# Altium project Claraboia.PrjPcb (part 1 of 2)
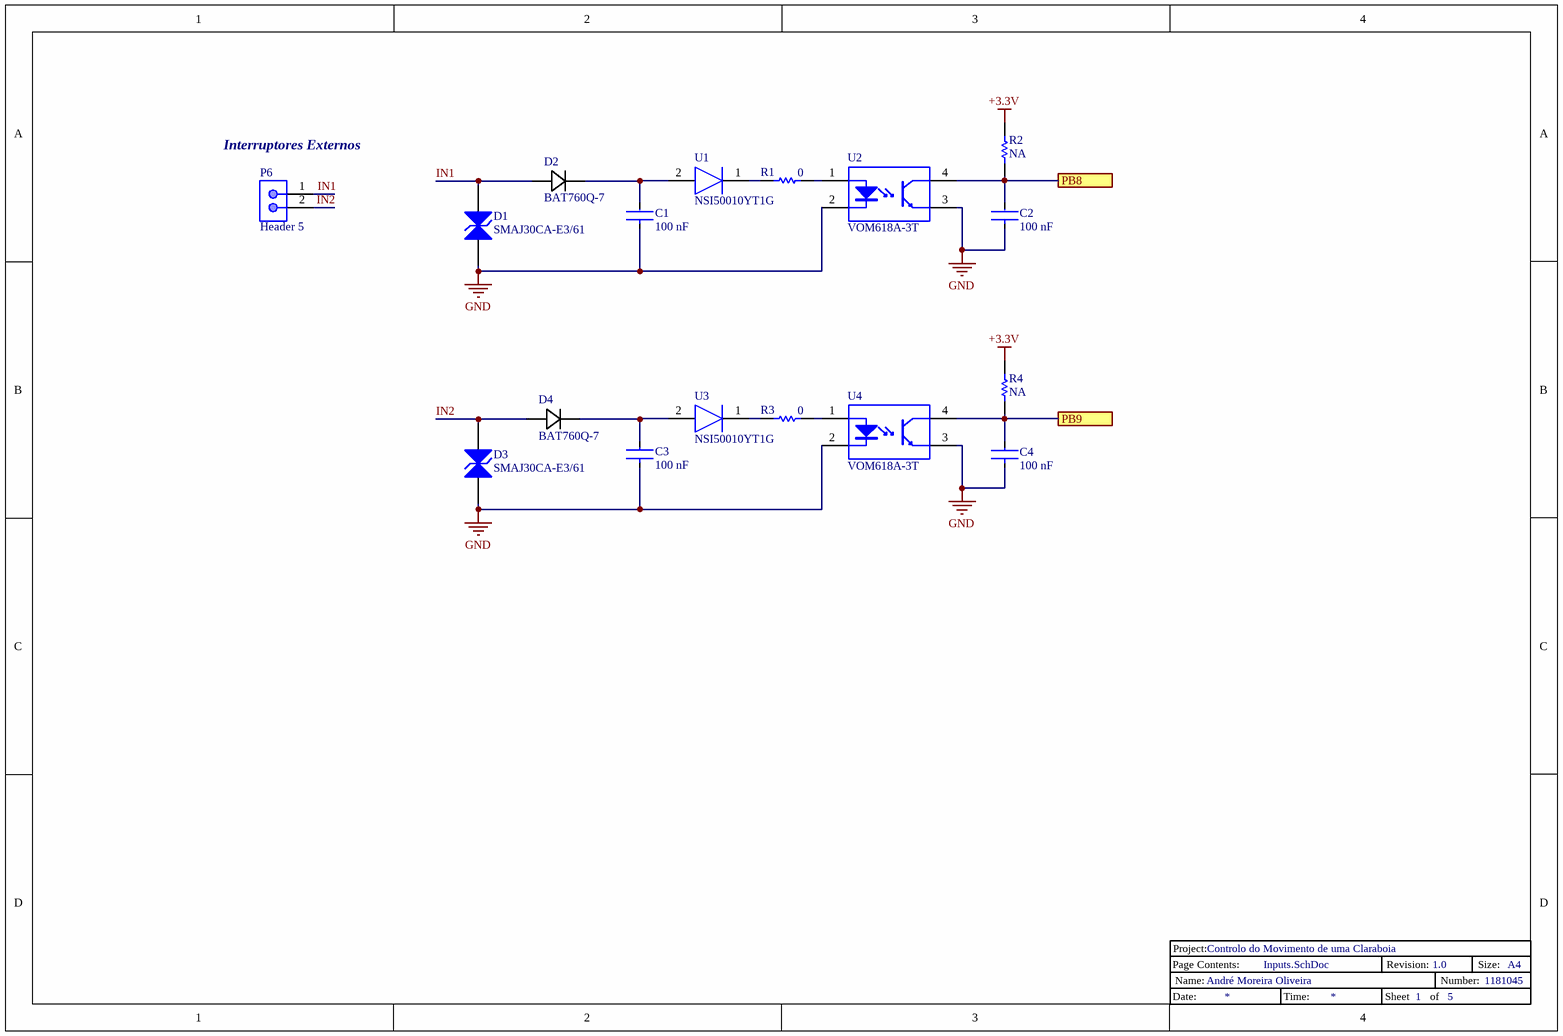
[diagram p0: Inputs.SchDoc]
AuthorProject: André Moreira Oliveira; Number: 1181045; Project: Controlo do Movimento de uma Claraboia; RevisionSch: 1.0
5 sheets, 189 parts. Net scope: flat (ports and power ports of the same name join across sheets).
Board file: PCB2.PcbDoc
Sheets:
  Inputs.SchDoc
  Source.SchDoc
  RS-485.SchDoc
  MCU_F401RE.SchDoc
  powerSTEP01.SchDoc

## Sheet Inputs.SchDoc: Controlo do Movimento de uma Claraboia
size A4; Author: André Moreira Oliveira; DocumentNumber: 1; Revision: 0.1; SheetNumber: 1; SheetTotal: 5; Number: 1181045

### Parts
C1  100 nF  [FP-CC0603-DA-MFG]
C2  100 nF  [FP-CC0603-DA-MFG]
C3  100 nF  [FP-CC0603-DA-MFG]
C4  100 nF  [FP-CC0603-DA-MFG]
D1  SMAJ30CA-E3/61  [VISH-DO-214AC-2_L]
D2  BAT760Q-7  [DIODE_SOD-323_1P7X1P3_DIO-L]
D3  SMAJ30CA-E3/61  [VISH-DO-214AC-2_L]
D4  BAT760Q-7  [DIODE_SOD-323_1P7X1P3_DIO-L]
P6  Header 5  [MOLX-22-27-2021_V]
R1  0  [RESC1608X55X25ML10T15]
R2  NA  [RESC1608X55X25ML10T15]
R3  0  [RESC1608X55X25ML10T15]
R4  NA  [RESC1608X55X25ML10T15]
Title_Block_1  Title_Block  (value not drawn)
U1  NSI50010YT1G  [SOD3716X135N]
U2  VOM618A-3T  [VISH-SOP-4_V]
U3  NSI50010YT1G  [SOD3716X135N]
U4  VOM618A-3T  [VISH-SOP-4_V]

### Ports
PB8, PB9

### Nets
+3.3V: R2.2 R4.2
GND: C1.1 C2.1 C3.1 C4.1 D1.1(A1) D3.1(A1) U2.2(CATHODE) U2.3(EMITTER) U4.2(CATHODE) U4.3(EMITTER)
IN1: D1.2(A2) D2.2 P6.1
IN2: D3.2(A2) D4.2 P6.2
NetC1_2: C1.2 D2.1 U1.2(A)
NetC2_2: C2.2 R2.1 U2.4(COLLECTOR) ; port PB8
NetC3_2: C3.2 D4.1 U3.2(A)
NetC4_2: C4.2 R4.1 U4.4(COLLECTOR) ; port PB9
NetR1_1: R1.1 U1.1(K)
NetR1_2: R1.2 U2.1(ANODE)
NetR3_1: R3.1 U3.1(K)
NetR3_2: R3.2 U4.1(ANODE)

### Notes on the sheet
- (near P6) Interruptores Externos
- (in symbol Title_Block) Project:; Page Contents:; Revision:; Size:; A4; Name:; Number:; Date:; Time:; Sheet; of

### Library data of the parts
C1-C4 = CMP-2100-03601-2: CAP CER 0.1UF 50V X7R 0603; Manufacturer: YAGEO; Manufacturer Part Number: CC0603KRX7R9BB104; Material: Ceramic; Temperature Coefficient: 15%; Tolerance: 0.1; Height: 0.9mm; Voltage: 50 V; ComponentLink2Description: Datasheet; Device Class L2: Capacitors; Temperature Range High: +125°C; Category: Cap; Capacitance: 100 nF; Footprint Url: http://www.yageo.com/exep/pages/download/literatures/UPY-C_GEN_24.pdf; ComponentLink2URL: http://www.yageo.com/documents/recent/UPY-GPHC_X7R_6.3V-to-50V_18.pdf; Package: CC0603-DA; Temperature: -55°C to +125°C; Voltage Rating: 50 V; Temperature Characteristic: X7R; Device Class L1: Passive Components; Temperature Range Low: -55°C; RoHS: TRUE; Automotive: No; Value: 100 nF; Device Class L3: Ceramic Capacitors; Octopart: https://octopart.com/cc0603krx7r9bb104-yageo-42244635; Mouser Description: Multilayer Ceramic Capacitor, CC Series, 0.1 - F, - 10%, X7R, 50 V, 0603 [1608 Metric]; Lead Free: Yes; Digikey Description: CAP CER 0.1UF 50V X7R 0603
D1 D3 = CMP-0548-00185-2: Transient Voltage Suppressor, 6.40 to 231 V, 30 V Stand-off Voltage, Bi-Directional, -55 to 155 degC, 2-pin DO-214AC, Pb-Free, Tape and Reel; Manufacturer: Vishay Semiconductor; ID (uA): 2; IFSM: 40 A; PPPM (W): 400, 300; VWM (V): 30; VBR Bi-Directional (V): 6.4 to 231; PartNumber: SMAJ30CA-E3/61; Mounting Technology: Surface Mount; Operating Junction and Storage Temperature Range: -55 to 150 degC; ComponentLink1Description: Manufacturer URL; PackageReference: DO-214AC-2; ComponentLink3URL: http://www.vishay.com/docs/88390/smaj50a.pdf; ComponentLink2URL: http://www.vishay.com/docs/88390/smaj50a.pdf; RoHS: TRUE; DatasheetVersion: 12/8/2013; Packing: Tape and Reel; ComponentLink1URL: http://www.vishay.com/; ComponentLink2Description: Datasheet; ComponentLink3Description: Package Specification; PackageDescription: 2-Pin DO-214AC (SMA), Body 4.245 x 2.665 mm
D2 D4 = BAT760Q-7: No Description Available; Vendor: Diodes Inc; Built_By: EMA_Anthony; SourceLibrary: Diodes_Inc_2020-03-05; Type: DEV; Datasheet: https://media.digikey.com/pdf/Data%20Sheets/Diodes%20PDFs/BAT760.pdf; Copyright: Copyright (C) 2018 Accelerated Designs. All rights reserved; Manufacturer_Part_Number: BAT760Q-7; RefDes: RefDes
P6 = CMP-2000-05537-1: Male Header, Pitch 2.54 mm, 1 x 2 Position, Height 11.7 mm, Tail Length 3.56 mm, 0 to 75 degC, RoHS, Bulk; Manufacturer: Molex; PartNumber: 0022272021; Current rating: 4A; Package Version: Rev. BC, 02/2012; Voltage rating: 250V; No. of Positions: 2; Pitch: 2.54mm; No. of Rows: 1; Orientation: Vertical; Operating temperature: 0°Cto+75°C; Manufacturer URL: http://www.molex.com/; Mounting Technology: ThroughHole; Housing material: Nylon(UL94V-0); Package Description: 2-Leads Header, Body 5.08 x 5.8 mm, Pitch 2.54 mm; Voltage - Max: 250V; Datasheet URL: http://www.molex.com/pdm_docs/sd/022272021_sd.pdf; Package Reference: 22-27-2021; Contact material: Tinplatedbrass; Current - Max: 4A; Datasheet Version: Rev. F, 06/2009
R1-R4 = CMP-2100-03667-1: Chip Resistor, 0 Ohm, +/- 5%, 0.1 W, -55 to 155 degC, 0603 (1608 Metric), RoHS, Tape and Reel; Manufacturer: Yageo; Temperature Coefficient: 200ppm/degreesC; Voltage Rating: 50V; Power Rating: 100mW; Resistance: 0mOhm; Width: 0.8mm; Max Operating Temperature: 155degC; Tolerance: 5%; Package Reference: 0603; Height: 0.45mm; Depth: 0.8mm; Package Description: 2-Pin Surface Mount Device, Body 1.6 x 0.8 mm; Termination: SMD/SMT; Package Quantity: 5000; Case/Package: 0603; Case Code (Imperial): 0603; Radiation Hardening: No; Number of Pins: 2; Length: 1.6mm; Lead Free: LeadFree; Voltage Rating (DC): 50V; Military Standard: Not; Datasheet URL: http://www.yageo.com/NewPortal/yageodocoutput?fileName=/pdf/R-Chip/PYu-RC_Group_51_RoHS_L_5.pdf; Manufacturer URL: http://www.yageo.com/; Packaging: TapeandReel; Case Code (Metric): 1608; Min Operating Temperature: -55degC; Composition: ThickFilm; RoHSCompliant: true; Contact Plating: Tin; Datasheet Version: Rev. 5, 10/2016; REACH SVHC: NoSVHC
U1 U3 = NSI50010YT1G: Diode; Manufacturer_Name: ON Semiconductor; Datasheet Link: http://www.onsemi.com/pub/Collateral/NSI50010Y-D.PDF; Height: 1.35mm; Manufacturer_Part_Number: NSI50010YT1G; Mouser Part Number: 863-NSI50010YT1G; Mouser Price/Stock: https://www.mouser.co.uk/ProductDetail/ON-Semiconductor/NSI50010YT1G?qs=dubiLKbpNDpeXNVeIAV4bg%3D%3D; Arrow Part Number: NSI50010YT1G; Arrow Price/Stock: https://www.arrow.com/en/products/nsi50010yt1g/on-semiconductor
U2 U4 = CMP-2000-07401-1: Low Input Current, Phototransistor Output, 80 V, 170 mW, -55 to 110 degC, 4-Pin SOP, RoHS, Tape and Reel; Manufacturer: Vishay; Input Type: DC; Voltage - Isolation: 3750Vrms; Turn On / Turn Off Time (Typ): 7µs,6µs; Current Transfer Ratio (Min): 100%@1mA; Current - DC Forward (If) (Max): 60mA; Online Catalog: VOM617A,VOM618ASeries; Voltage - Output (Max): 80V; Voltage - Forward (Vf) (Typ): 1.1V; Current - Output / Channel: 50mA; Rise / Fall Time (Typ): 5µs,4µs; Other Names: VOM618A-3CT; Current Transfer Ratio (Max): 200%@1mA; Number of Channels: 1; Vce Saturation (Max): 400mV; Category: Isolators; Standard Package: 1; Mounting Type: SurfaceMount; Output Type: Transistor; Mounting Technology: SurfaceMount; Manufacturer URL: http://www.vishay.com/; Package Reference: SOP-4; Supplier Device Package: 4-SOP(2.54mm); Packaging: CutTape(CT); Family: Optoisolators-Transistor,PhotovoltaicOutput; Datasheet Version: Rev. 1.4, 10/2013; Package Description: 4-Pin Small Outline Package Integrated Circuit, Body 4.4 x 3.85 mm, Pitch 2.54 mm; Operating Temperature: -55°C~110°C; Series: -; Package / Case: 4-SMD,GullWing; Datasheet URL: http://download.siliconexpert.com/pdfs/2016/3/15/21/48/34/980/vsh_/manual/832624671428055vom618a.pdf

## Sheet Source.SchDoc
size A4; DocumentNumber: 2; SheetNumber: 2; SheetTotal: 5
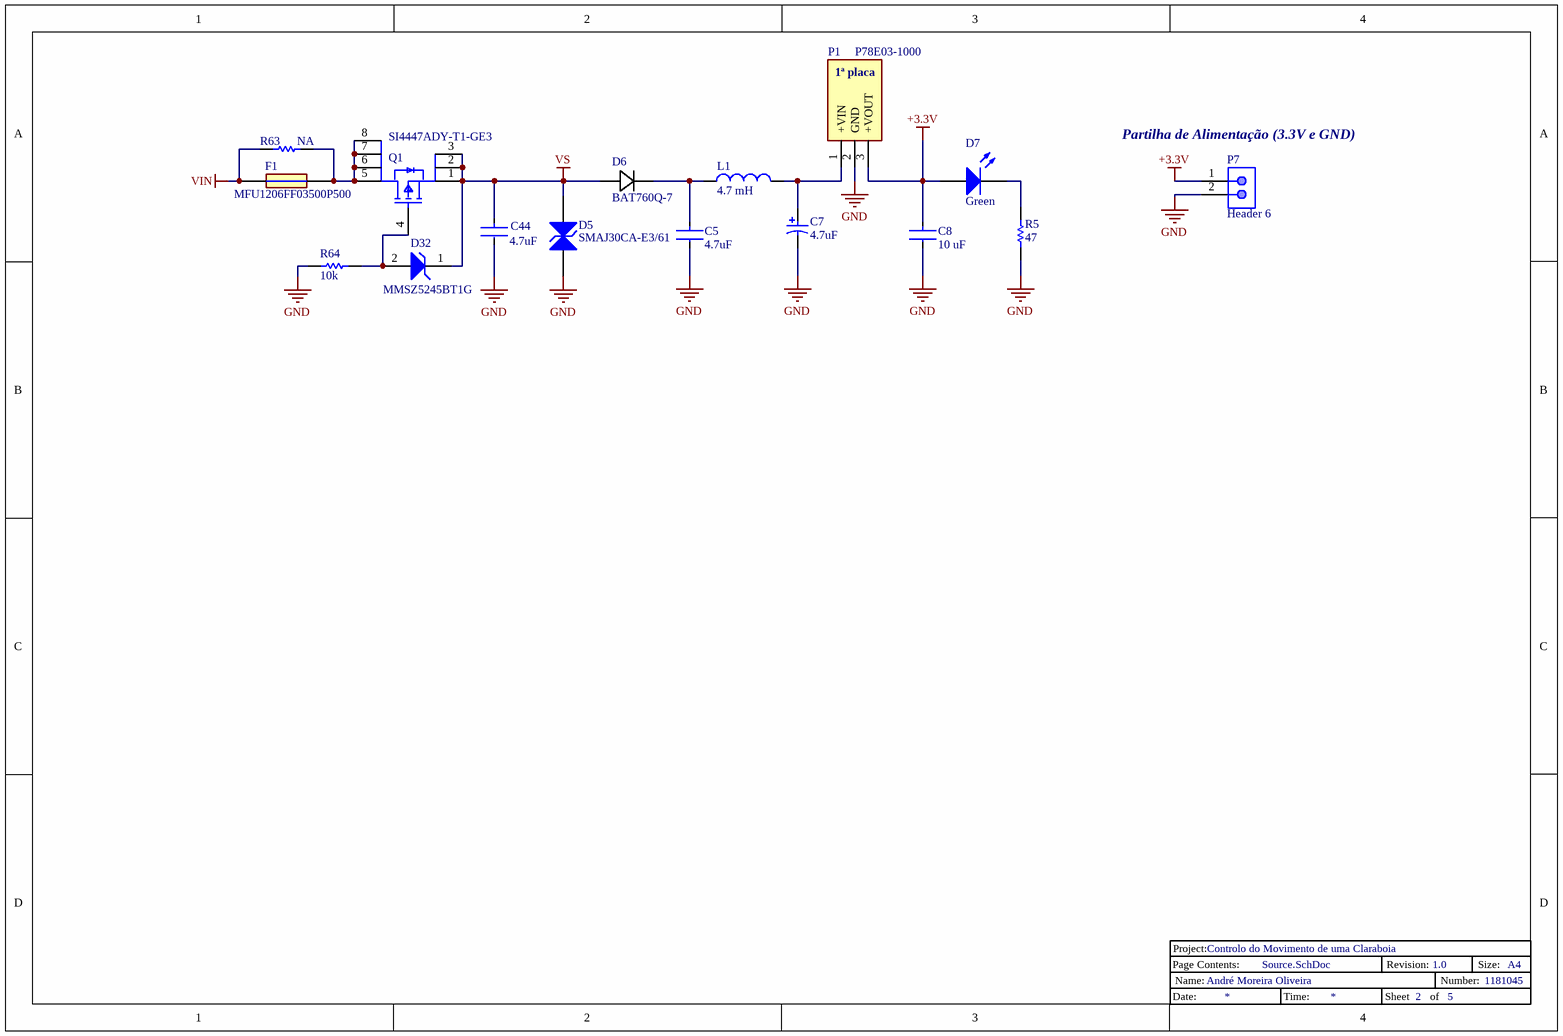
[diagram p1: Source.SchDoc]

### Parts
C5  4.7uF  [FP-GRT21B-0_15-IPC_B]
C7  4.7uF  [KEMT-T491-D_L]
C8  10 uF  [FP-GRM21B-0_2-e0_2_0_7-IPC_C]
C44  4.7uF  [FP-GRT21B-0_15-IPC_B]
D5  SMAJ30CA-E3/61  [VISH-DO-214AC-2_L]
D6  BAT760Q-7  [DIODE_SOD-323_1P7X1P3_DIO-L]
D7  Green  [0805_A]
D32  MMSZ5245BT1G  [ONSC-SOD-123-2-425-04_V]
F1  MFU1206FF03500P500  [RESC3216X65N]
L1  4.7 mH  [WE-TI-LM]
P1  P78E03-1000  [P78E031000]
P7  Header 6  [MOLX-22-27-2021_V]
Q1  SI4447ADY-T1-GE3  [FP-C-06527-MFG]
R5  47  [RESC1608X55X30NL20T20]
R63  NA  [RESC1608X55X25ML10T15]
R64  10k  [RESC1608X55X25ML10T15]
Title_Block_2  Title_Block  (value not drawn)

### Nets
+3.3V: C8.1 D7.2(A) P1.3(+VOUT) P7.1
GND: C5.2 C7.2 C8.2 C44.2 D5.2(A2) P1.2(GND) P7.2 R5.1 R64.1
VIN: F1.1 R63.1
VS: C44.1 D5.1(A1) D6.2 D32.1(K) Q1.1(S) Q1.2(S) Q1.3(S)
NetC5_1: C5.1 D6.1 L1.1
NetC7_1: C7.1 L1.2 P1.1(+VIN)
NetD7_1: D7.1(K) R5.2
NetD32_2: D32.2(A) Q1.4(G) R64.2
NetF1_2: F1.2 Q1.5(D) Q1.6(D) Q1.7(D) Q1.8(D) R63.2

### Notes on the sheet
- 1ª placa
- (near P7) Partilha de Alimentação (3.3V e GND)
- (in symbol Title_Block) Project:; Page Contents:; Revision:; Size:; A4; Name:; Number:; Date:; Time:; Sheet; of

### Library data of the parts
C5 C44 = CMP-06035-019733-1: Cap Ceramic 4.7uF 50V X5R ±10% SMD 0805 +85°C Emboss T/R; Voltage Rating: 50V; Mount: Surface Mount; Ratings: AEC-Q200; Packaging: Tape and Reel; Width: 0.049inch; Case/Package: 0805; Max Operating Temperature: 85°C; Length: 0.079inch; Case Code (Imperial): 0805; Capacitance: 4.7uF; Thickness: 0.057inch; Min Operating Temperature: -55°C; Case Code (Metric): 2012; Dielectric: X5R; Tolerance: 10%; Voltage Rating (DC): 50V
C7 = CMP-2000-07203-1: Tantalum Surface Mount Capacitor, 4.7 uF, +/- 20%, 50 V, -55 to 125 degC, 2-Pin SMD, RoHS, Tape and Reel T491D475M050AT; Manufacturer: Kemet; DF: 6%; Polarity: Polar; Voltage: 50VDC; Product Depth (mm): 4.3mm; Insulation: NotRequired; DCL: 2.4uA; Product Height (mm): 2.8mm; Rad Hardened: No; Capacitance: 4700000pF; Product Length (mm): 7.3mm; ESR: 1.4ohm; Case Style: Molded; Lead Spacing (nom): NotRequiredmm; Packaging: TapeandReel; Operating Temp Range: -55Cto125C; Mounting Style: SurfaceMount; Length W/Weld (max): NotRequiredmm; Package Reference: T491-D; Construction: SMTChip; Case Code: D; Package Description: 2-Pin Surface Mount Device, Body 7.3 x 4.3 mm; Seated Plane Height: NotRequiredmm; Wire Form: NotRequired; Mounting Technology: SurfaceMount; Manufacturer URL: http://www.kemet.com/; Seal: NotRequired; Tolerance (+ or -): 20%; Failure Rate: NotRequired; Datasheet Version: 06/2016; Length W/Weld: NotRequiredmm; Package / Case: 7343-31; Product Diameter (mm): NotRequiredmm; Datasheet URL: http://www.kemet.com/Lists/ProductCatalog/Attachments/254/KEM_T2005_T491.pdf
C8 = CMP-06035-005015-1: Chip Multilayer Ceramic Capacitors for General Purpose, 0805, 10uF, X5R, 15%, 10%, 50V GRM21BR61H106KE43K
D5 = CMP-0548-00185-2: as D1 on sheet Inputs; PartNumber: SMAJ30CA-E3/61; Mounting Technology: Surface Mount; Operating Junction and Storage Temperature Range: -55 to 150 degC; ComponentLink1Description: Manufacturer URL; PackageReference: DO-214AC-2; ComponentLink3URL: http://www.vishay.com/docs/88390/smaj50a.pdf; ComponentLink2URL: http://www.vishay.com/docs/88390/smaj50a.pdf; RoHS: TRUE; DatasheetVersion: 12/8/2013; Packing: Tape and Reel; ComponentLink1URL: http://www.vishay.com/; ComponentLink2Description: Datasheet; ComponentLink3Description: Package Specification; PackageDescription: 2-Pin DO-214AC (SMA), Body 4.245 x 2.665 mm
D6 = BAT760Q-7: as D2 on sheet Inputs; Datasheet: https://media.digikey.com/pdf/Data%20Sheets/Diodes%20PDFs/BAT760.pdf; Copyright: Copyright (C) 2018 Accelerated Designs. All rights reserved; Manufacturer_Part_Number: BAT760Q-7; RefDes: RefDes
D7 = CMP-1426-00009-1: SMD mono-color Chip LED, WL-SMCW, Bright Green; PartNumber: 150080VS75000; Manufacturer: Wuerth Elektronik; ComponentLink1Description: Manufacturer URL; Color: Bright Green; PackageReference: 0805_A; ComponentLink1URL: http://www.we-online.com; ComponentLink2Description: Datasheet; ComponentLink2URL: http://katalog.we-online.com/led/datasheet/150080VS75000.pdf
D32 = CMP-1060-00535-1: Zener Voltage Regulator, 500 mW, 2-Pin SOD-123, Pb-Free, Tape and Reel; Manufacturer: On Semiconductor; P Max (W): 0.5; VZ Typ (V): 15; ComponentLink3URL: http://www.onsemi.com/pub_link/Collateral/425-04.PDF; Packing: Tape and Reel; DatasheetVersion: Rev. 12; ComponentLink2URL: http://www.onsemi.com/pub_link/Collateral/MMSZ5221BT1-D.PDF; Mounting Technology: Surface Mount; ComponentLink1Description: Manufacturer URL; ComponentLink1URL: http://www.onsemi.com/; ComponentLink2Description: Datasheet; PackageVersion: Rev. G, 10/2009; PackageReference: SOD-123-2-425-04; PackageDescription: 2-Pin SOD, Body 1.6 x 2.69 mm; ComponentLink3Description: Package Specification; RoHS: Pb-Free; PartNumber: MMSZ5245BT1G
F1 = MFU1206FF00500P100: Fuse; Manufacturer_Name: Vishay; Datasheet Link: http://www.vishay.com/docs/28747/mfuserie.pdf; Height: 0.65mm; Manufacturer_Part_Number: MFU1206FF00500P100; Mouser Part Number: 594-MFU1206FF00500P1; Mouser Price/Stock: https://www.mouser.co.uk/ProductDetail/Vishay-Beyschlag/MFU1206FF00500P100?qs=oI046glRurs9%2FzbQ%2Fl2sBw%3D%3D; Arrow Part Number: MFU1206FF00500P100; Arrow Price/Stock: https://www.arrow.com/en/products/mfu1206ff00500p100/vishay
L1 = CMP-0225-00066-1: Radial Leaded Wire Wound Inductor WE-TI, L = 4700 µH 7447721047; Inductance: 4700 ÂµH; DatasheetVersion: ver 3, Feb-2008; ComponentLink2Description: Datasheet; PackageVersion: 2008; ComponentLink1Description: Manufacturer Link; PackageDescription: THT Inductor, 2-Leads, Body 7.8 x 7.8 mm; PackageReference: WE-TI-LM; ComponentLink1URL: http://www.we-online.com; ComponentLink2URL: http://www.we-online.de/katalog/media/pdf/7447721047.pdf
P1 = P78E03-1000: Connector; Manufacturer_Name: CUI Inc.; Datasheet Link: https://www.mouser.com/datasheet/2/670/p78e-1000-1480573.pdf; Height: 10.9mm; Manufacturer_Part_Number: P78E03-1000; Mouser Part Number: 490-P78E03-1000; Mouser Price/Stock: https://www.mouser.co.uk/ProductDetail/CUI-Inc/P78E03-1000?qs=qSfuJ%252Bfl%2Fd7nA5RBt1peaw%3D%3D; Arrow Part Number: P78E03-1000; Arrow Price/Stock: https://www.arrow.com/en/products/p78e03-1000/cui-inc
P7 = CMP-2000-05537-1: as P6 on sheet Inputs; Orientation: Vertical; Operating temperature: 0°Cto+75°C; Manufacturer URL: http://www.molex.com/; Mounting Technology: ThroughHole; Housing material: Nylon(UL94V-0); Package Description: 2-Leads Header, Body 5.08 x 5.8 mm, Pitch 2.54 mm; Voltage - Max: 250V; Datasheet URL: http://www.molex.com/pdm_docs/sd/022272021_sd.pdf; Package Reference: 22-27-2021; Contact material: Tinplatedbrass; Current - Max: 4A; Datasheet Version: Rev. F, 06/2009
Q1 = CMP-02550-000125-1: MOSFET P-CH 40V 7.2A 8SOIC; Manufacturer: Vishay; Standoff Height: 0.1mm; Max Forward Diode Voltage: -1.2V; Turn Off Delay Time: 30ns; Number Of P Channels: 1; Depletion Mode: False; Typ Forward Diode Voltage: -0.76V; Pulse Drain Current: -20A; Gate Charge At Vgs: 25nC @ -10V; Rthja Max: 40°C/W; Transconductance: 14S; Reverse Recovery Time: 27ns; Continuous Drain Current: -5.5A; Drain To Source Voltage: -40V; Max Junction Temp: +150°C; Input Capacitace At Vds: 970pF @ -20V; Turn On Delay Time: 7ns; Threshold Vgs Max: -2.5V; Drain To Source Resistance: 0.036Ω; Gate To Source Voltage: 20V; Reverse Recovery Charge: 19nC; Power Dissipation: 2.5W; Temperature: -55°C to +150°C; Device Class L3: MOSFETs; Manufacturer Part Number: SI4447ADY-T1-GE3; Temperature Range Low: -55°C; Octopart: https://octopart.com/si4447ady-t1-ge3-vishay-44677033; ComponentLink2Description: Datasheet; Threshold Vgs Min: -1.2V; Automotive: No; ComponentLink2URL: http://www.vishay.com/docs/67189/si4447ad.pdf; Category: Trans; Package: C-06527; Device Class L1: Discrete Semiconductors; Number Of Channels: 1; Digikey Description: MOSFET P-CH 40V 7.2A 8SOIC; Mouser Description: Si4447ADY Series 40 V 45 mOhm 7.2 A Surface Mount P-Channel Mosfet - SOIC-8; Temperature Range High: +150°C; Height: 1.75mm; Drain To Source Breakdown Voltage: -40V; Lead Free: Yes; Device Class L2: Transistors; RoHS: TRUE
R5 = CMP-2000-00070-1: Part Number: ERA3AEB470V; Manufacturer: Panasonic
R63 = CMP-2100-03667-1: as R1 on sheet Inputs; Width: 0.8mm; Max Operating Temperature: 155degC; Tolerance: 5%; Package Reference: 0603; Height: 0.45mm; Depth: 0.8mm; Package Description: 2-Pin Surface Mount Device, Body 1.6 x 0.8 mm; Termination: SMD/SMT; Package Quantity: 5000; Case/Package: 0603; Case Code (Imperial): 0603; Radiation Hardening: No; Number of Pins: 2; Length: 1.6mm; Lead Free: LeadFree; Voltage Rating (DC): 50V; Military Standard: Not; Datasheet URL: http://www.yageo.com/NewPortal/yageodocoutput?fileName=/pdf/R-Chip/PYu-RC_Group_51_RoHS_L_5.pdf; Manufacturer URL: http://www.yageo.com/; Packaging: TapeandReel; Case Code (Metric): 1608; Min Operating Temperature: -55degC; Composition: ThickFilm; RoHSCompliant: true; Contact Plating: Tin; Datasheet Version: Rev. 5, 10/2016; REACH SVHC: NoSVHC
R64 = CMP-2000-05022-1: Resistor, 10 kOhm, +/- 5%, 100 mW, -55 to 155 degC, 0603 (1608 Metric), RoHS, Tape and Reel; Manufacturer: Yageo; Resistance: 10kOhms; Voltage Rating: 50V; Temperature Coefficient: 100PPM/C; Power Rating: 100mW; Package Reference: 603; Series: RC; Case Code - mm: 1608; Packaging: Reel; Datasheet URL: http://www.farnell.com/datasheets/443971.pdf; Datasheet Version: Rev. 4, 04/2009; Operating Temperature Range: -55Cto+155C; Product: ThickFilmResistorsGeneralPurpose; Package Description: 2-Pin Surface Mount Device, Body 1.6 x 0.8 mm; Manufacturer URL: http://www.yageo.com/; Case Code - in: 0603; Tolerance: 5%; Termination Style: SMD/SMT

## Sheet RS-485.SchDoc
size A4; DocumentNumber: 3; SheetNumber: 3; SheetTotal: 5
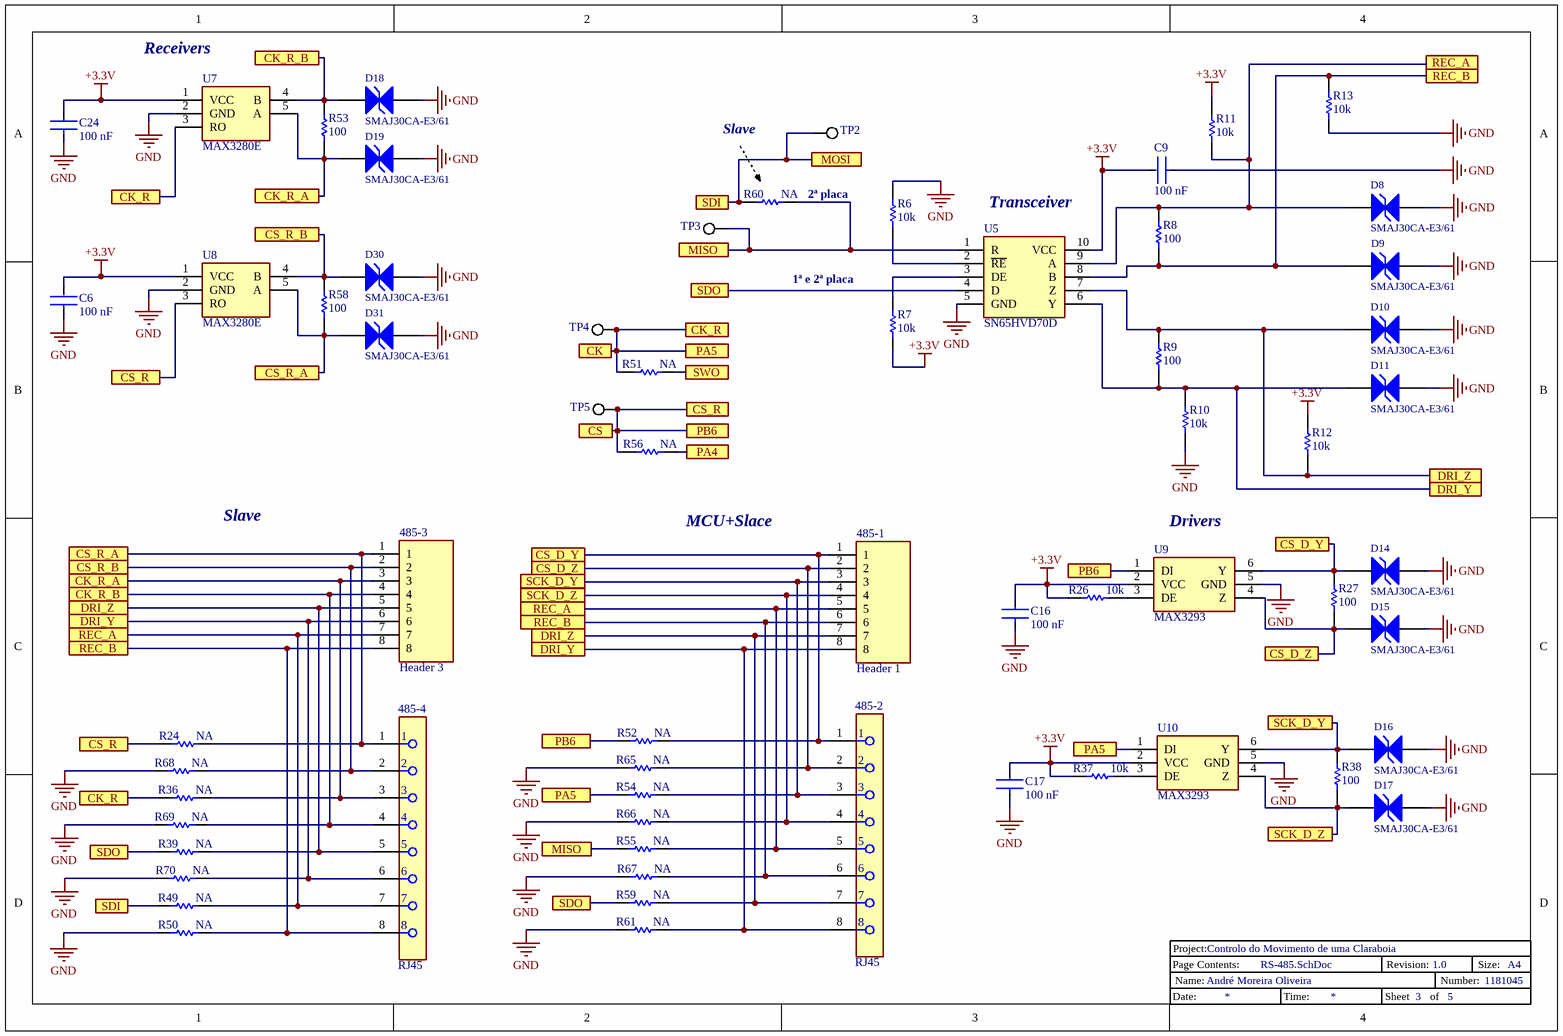
[diagram p2: RS-485.SchDoc]

### Parts
485-1  Header 1  [SHDRRA8W64P0X250_1X8_2250X820X420P]
485-2  RJ45  [FP-RJHSE-5080-MFG]
485-3  Header 3  [SHDRRA8W64P0X250_1X8_2250X820X420P]
485-4  RJ45  [FP-RJHSE-5080-MFG]
C6  100 nF  [FP-CC0603-DA-MFG]
C9  100 nF  [FP-CC0603-DA-MFG]
C16  100 nF  [FP-CC0603-DA-MFG]
C17  100 nF  [FP-CC0603-DA-MFG]
C24  100 nF  [FP-CC0603-DA-MFG]
D8  SMAJ30CA-E3/61  [VISH-DO-214AC-2_L]
D9  SMAJ30CA-E3/61  [VISH-DO-214AC-2_L]
D10  SMAJ30CA-E3/61  [VISH-DO-214AC-2_L]
D11  SMAJ30CA-E3/61  [VISH-DO-214AC-2_L]
D14  SMAJ30CA-E3/61  [VISH-DO-214AC-2_L]
D15  SMAJ30CA-E3/61  [VISH-DO-214AC-2_L]
D16  SMAJ30CA-E3/61  [VISH-DO-214AC-2_L]
D17  SMAJ30CA-E3/61  [VISH-DO-214AC-2_L]
D18  SMAJ30CA-E3/61  [VISH-DO-214AC-2_L]
D19  SMAJ30CA-E3/61  [VISH-DO-214AC-2_L]
D30  SMAJ30CA-E3/61  [VISH-DO-214AC-2_L]
D31  SMAJ30CA-E3/61  [VISH-DO-214AC-2_L]
R6  10k  [RESC1608X55X25ML10T15]
R7  10k  [RESC1608X55X25ML10T15]
R8  100  [RESC1608X55X25ML10T15]
R9  100  [RESC1608X55X25ML10T15]
R10  10k  [RESC1608X55X25ML10T15]
R11  10k  [RESC1608X55X25ML10T15]
R12  10k  [RESC1608X55X25ML10T15]
R13  10k  [RESC1608X55X25ML10T15]
R24  NA  [RESC1608X55X25ML10T15]
R26  10k  [RESC1608X55X25ML10T15]
R27  100  [RESC1608X55X25ML10T15]
R36  NA  [RESC1608X55X25ML10T15]
R37  10k  [RESC1608X55X25ML10T15]
R38  100  [RESC1608X55X25ML10T15]
R39  NA  [RESC1608X55X25ML10T15]
R49  NA  [RESC1608X55X25ML10T15]
R50  NA  [RESC1608X55X25ML10T15]
R51  NA  [RESC1608X55X25ML10T15]
R52  NA  [RESC1608X55X25ML10T15]
R53  100  [RESC1608X55X25ML10T15]
R54  NA  [RESC1608X55X25ML10T15]
R55  NA  [RESC1608X55X25ML10T15]
R56  NA  [RESC1608X55X25ML10T15]
R58  100  [RESC1608X55X25ML10T15]
R59  NA  [RESC1608X55X25ML10T15]
R60  NA  [RESC1608X55X25ML10T15]
R61  NA  [RESC1608X55X25ML10T15]
R65  NA  [RESC1608X55X25ML10T15]
R66  NA  [RESC1608X55X25ML10T15]
R67  NA  [RESC1608X55X25ML10T15]
R68  NA  [RESC1608X55X25ML10T15]
R69  NA  [RESC1608X55X25ML10T15]
R70  NA  [RESC1608X55X25ML10T15]
Title_Block_3  Title_Block  (value not drawn)
TP2  5000  [KSTN-5002]  (value not drawn)
TP3  5000  [KSTN-5002]  (value not drawn)
TP4  5000  [KSTN-5002]  (value not drawn)
TP5  5000  [KSTN-5002]  (value not drawn)
U5  SN65HVD70D  [SOP50P490X110-10N]
U7  MAX3280E  [SOT95P280X145-5N]
U8  MAX3280E  [SOT95P280X145-5N]
U9  MAX3293  [SOT95P280X145-6N]
U10  MAX3293  [SOT95P280X145-6N]

### Ports
CK, CK_R, CK_R_A, CK_R_B, CS, CS_D_Y, CS_D_Z, CS_R, CS_R_A, CS_R_B, DRI_Y, DRI_Z, MISO, MOSI, PA4, PA5, PB6, REC_A, REC_B, SCK_D_Y, SCK_D_Z, SDI, SDO, SWO

### Nets
+3.3V: C6.2 C9.2 C16.2 C17.2 C24.2 R7.1 R11.2 R12.2 R26.1 R37.1 U5.10(VCC) U7.1(VCC) U8.1(VCC) U9.2(VCC) U10.2(VCC)
GND: C6.1 C9.1 C16.1 C17.1 C24.1 D8.1(A1) D9.1(A1) D10.1(A1) D11.1(A1) D14.1(A1) D15.1(A1) D16.1(A1) D17.1(A1) D18.1(A1) D19.1(A1) D30.1(A1) D31.1(A1) R6.2 R10.1 R13.1 R50.1 R61.1 R65.1 R66.1 R67.1 R68.1 R69.1 R70.1 U5.5(GND) U7.2(GND) U8.2(GND) U9.5(GND) U10.5(GND)
Net485-1_1: 485-1.1 485-2.1 D14.2(A2) R27.2 R52.2 U9.6(Y) ; port CS_D_Y
Net485-1_2: 485-1.2 485-2.2 D15.2(A2) R27.1 R65.2 U9.4(Z) ; port CS_D_Z
Net485-1_3: 485-1.3 485-2.3 D16.2(A2) R38.2 R54.2 U10.6(Y) ; port SCK_D_Y
Net485-1_4: 485-1.4 485-2.4 D17.2(A2) R38.1 R66.2 U10.4(Z) ; port SCK_D_Z
Net485-1_5: 485-1.5 485-2.5 485-3.7 485-4.7 D8.2(A2) R8.2 R11.1 R49.2 R55.2 U5.9(A) ; port REC_A
Net485-1_6: 485-1.6 485-2.6 485-3.8 485-4.8 D9.2(A2) R8.1 R13.2 R50.2 R67.2 U5.8(B) ; port REC_B
Net485-1_7: 485-1.7 485-2.7 485-3.5 485-4.5 D10.2(A2) R9.2 R12.1 R39.2 R59.2 U5.7(Z) ; port DRI_Z
Net485-1_8: 485-1.8 485-2.8 485-3.6 485-4.6 D11.2(A2) R9.1 R10.2 R61.2 R70.2 U5.6(Y) ; port DRI_Y
Net485-3_1: 485-3.1 485-4.1 D31.2(A2) R24.2 R58.1 U8.5(A) ; port CS_R_A
Net485-3_2: 485-3.2 485-4.2 D30.2(A2) R58.2 R68.2 U8.4(B) ; port CS_R_B
Net485-3_3: 485-3.3 485-4.3 D19.2(A2) R36.2 R53.1 U7.5(A) ; port CK_R_A
Net485-3_4: 485-3.4 485-4.4 D18.2(A2) R53.2 R69.2 U7.4(B) ; port CK_R_B
NetP2_6: R51.2 ; port SWO
NetR6_1: R6.1 U5.2(~{RE})
NetR7_2: R7.2 U5.3(DE)
NetR24_1: R24.1 R52.1 R56.1 TP5.1 U8.3(RO) U9.1(DI) ; port CS_R, port PB6, port CS
NetR26_2: R26.2 U9.3(DE)
NetR36_1: R36.1 R51.1 R54.1 TP4.1 U7.3(RO) U10.1(DI) ; port CK_R, port PA5, port CK
NetR37_2: R37.2 U10.3(DE)
NetR39_1: R39.1 R59.1 U5.4(D) ; port SDO
NetR49_1: R49.1 R60.1 TP2.1 ; port SDI, port MOSI
NetR55_1: R55.1 R60.2 TP3.1 U5.1(R) ; port MISO
NetR56_2: R56.2 ; port PA4

### Notes on the sheet
- (near U7) Receivers
- Slave
- 2ª placa
- (near U5) Transceiver
- 1ª e 2ª placa
- MCU+Slace
- (near U9) Drivers
- (in symbol Title_Block) Project:; Page Contents:; Revision:; Size:; A4; Name:; Number:; Date:; Time:; Sheet; of

### Library data of the parts
485-1 485-3 = S8B-EH_LF__SN_: Conector Femea 1*8 90 graus; Manufacturer_Name: JST (JAPAN SOLDERLESS TERMINALS); Manufacturer_Part_Number: S8B-EH(LF)(SN); Datasheet Link: http://www.jst-mfg.com/product/pdf/eng/eEH.pdf; Height: 4.2mm; Arrow Part Number: S8B-EH(LF)(SN); Arrow Price/Stock: https://www.arrow.com/en/products/s8b-eh-lf-sn/jst-manufacturing
485-2 485-4 = CMP-02366-000003-1: CONN MOD JACK 8P8C R/A UNSHLD; Manufacturer: Amphenol; Current Rating: 1.5A; Voltage Rating: 125V; Pitch: 1.02mm; Conn Orientation: Right Angle; Number Of Contacts: 8; Is Female: yes; Conn Gender: Female; Lead Free: Yes; Device Class L3: unset; Footprint Url: https://cdn.amphenol-icc.com/media/wysiwyg/files/drawing/rjhse5080.pdf?__cf_chl_jschl_tk__=e349db0bbbb6188a39347cd5e541b92fa02c9719-1587748343-0-AW7tChdeHzRPLX9gSWj7WrKaXQoY9BsmT9Ek0h-T62M9y3Rs9iypFcOtkzb-6sGYQEjFE-jcoNciDETCOZrh1rYyOesac5SvYLoLwHIsHvF4AKBlx-MXmfZUVk9OTTJLqyQq2qMm0PFRLJpNcK0nrKResqOniRSYixG2sPTmOPraH-ULJFBDL602CHqcI9KKBgTq90Jh1OL2Td4moJ99rFsJRJ1Tk_uoxGe8ublcP_ARu-uLpWcQrBcwOcHDTAwL29DAwVaqcH7ta8Ks7WMlHmVl_pILeEDwT0bE9vu5Pa5S3PtNRF1leuFkgi_FMbUxTDulc5xzbXSfng8srUIV1lWXny5nx1fZJEUa_w97yKjffzBMxiWLWVN-V7-uqAaPbyv_m-wRyw5O25OZNyJOeGU; ComponentLink2URL: https://cdn.amphenol-icc.com/media/wysiwyg/files/documentation/datasheet/inputoutput/io-modjack-rjhse.pdf; Device Class L1: Connectors; Package: CONN_MOD_JACK; Mouser Description: Modular Connectors / Ethernet Connectors R/A RJ45 NONSHIELDED 8 CONT NO LEDS; Manufacturer Part Number: RJHSE-5080; Octopart: https://octopart.com/rjhse-5080-amphenol-45060; Category: Conn; Height: 0.535inch; Temperature: -55°C to +85°C; Digikey Description: CONN MOD JACK 8P8C R/A UNSHLD; Device Class L2: Modular / Ethernet Connectors; Contact Material: Gold,Nickel; ComponentLink2Description: Datasheet; Temperature Range Low: -55°C; RoHS: TRUE; Automotive: No; Temperature Range High: +85°C
C6 C9 C16 C17 C24 = CMP-2100-03601-2: as C1 on sheet Inputs; Height: 0.9mm; Voltage: 50 V; ComponentLink2Description: Datasheet; Device Class L2: Capacitors; Temperature Range High: +125°C; Category: Cap; Capacitance: 100 nF; Footprint Url: http://www.yageo.com/exep/pages/download/literatures/UPY-C_GEN_24.pdf; ComponentLink2URL: http://www.yageo.com/documents/recent/UPY-GPHC_X7R_6.3V-to-50V_18.pdf; Package: CC0603-DA; Temperature: -55°C to +125°C; Voltage Rating: 50 V; Temperature Characteristic: X7R; Device Class L1: Passive Components; Temperature Range Low: -55°C; RoHS: TRUE; Automotive: No; Value: 100 nF; Device Class L3: Ceramic Capacitors; Octopart: https://octopart.com/cc0603krx7r9bb104-yageo-42244635; Mouser Description: Multilayer Ceramic Capacitor, CC Series, 0.1 - F, - 10%, X7R, 50 V, 0603 [1608 Metric]; Lead Free: Yes; Digikey Description: CAP CER 0.1UF 50V X7R 0603
D8-D11 D14-D19 D30 D31 = CMP-0548-00185-2: as D1 on sheet Inputs; PartNumber: SMAJ30CA-E3/61; Mounting Technology: Surface Mount; Operating Junction and Storage Temperature Range: -55 to 150 degC; ComponentLink1Description: Manufacturer URL; PackageReference: DO-214AC-2; ComponentLink3URL: http://www.vishay.com/docs/88390/smaj50a.pdf; ComponentLink2URL: http://www.vishay.com/docs/88390/smaj50a.pdf; RoHS: TRUE; DatasheetVersion: 12/8/2013; Packing: Tape and Reel; ComponentLink1URL: http://www.vishay.com/; ComponentLink2Description: Datasheet; ComponentLink3Description: Package Specification; PackageDescription: 2-Pin DO-214AC (SMA), Body 4.245 x 2.665 mm
R6 R7 R10-R13 R26 R37 = CMP-2000-05022-1: as R64 on sheet Source; Package Reference: 603; Series: RC; Case Code - mm: 1608; Packaging: Reel; Datasheet URL: http://www.farnell.com/datasheets/443971.pdf; Datasheet Version: Rev. 4, 04/2009; Operating Temperature Range: -55Cto+155C; Product: ThickFilmResistorsGeneralPurpose; Package Description: 2-Pin Surface Mount Device, Body 1.6 x 0.8 mm; Manufacturer URL: http://www.yageo.com/; Case Code - in: 0603; Tolerance: 5%; Termination Style: SMD/SMT
R8 R9 R27 R38 R53 R58 = CMP-2100-03667-1: Chip Resistor, 100 Ohm, +/- 5%, 0.1 W, -55 to 155 degC, 0603 (1608 Metric), RoHS, Tape and Reel; Manufacturer: Yageo; Temperature Coefficient: 200ppm/degreesC; Voltage Rating: 50V; Power Rating: 100mW; Resistance: 0mOhm; Width: 0.8mm; Max Operating Temperature: 155degC; Tolerance: 5%; Package Reference: 0603; Height: 0.45mm; Depth: 0.8mm; Package Description: 2-Pin Surface Mount Device, Body 1.6 x 0.8 mm; Termination: SMD/SMT; Package Quantity: 5000; Case/Package: 0603; Case Code (Imperial): 0603; Radiation Hardening: No; Number of Pins: 2; Length: 1.6mm; Lead Free: LeadFree; Voltage Rating (DC): 50V; Military Standard: Not; Datasheet URL: http://www.yageo.com/NewPortal/yageodocoutput?fileName=/pdf/R-Chip/PYu-RC_Group_51_RoHS_L_5.pdf; Manufacturer URL: http://www.yageo.com/; Packaging: TapeandReel; Case Code (Metric): 1608; Min Operating Temperature: -55degC; Composition: ThickFilm; RoHSCompliant: true; Contact Plating: Tin; Datasheet Version: Rev. 5, 10/2016; REACH SVHC: NoSVHC
R24 R36 R39 R49-R52 R54-R56 R59-R61 R65-R70 = CMP-2100-03667-1: as R1 on sheet Inputs; Width: 0.8mm; Max Operating Temperature: 155degC; Tolerance: 5%; Package Reference: 0603; Height: 0.45mm; Depth: 0.8mm; Package Description: 2-Pin Surface Mount Device, Body 1.6 x 0.8 mm; Termination: SMD/SMT; Package Quantity: 5000; Case/Package: 0603; Case Code (Imperial): 0603; Radiation Hardening: No; Number of Pins: 2; Length: 1.6mm; Lead Free: LeadFree; Voltage Rating (DC): 50V; Military Standard: Not; Datasheet URL: http://www.yageo.com/NewPortal/yageodocoutput?fileName=/pdf/R-Chip/PYu-RC_Group_51_RoHS_L_5.pdf; Manufacturer URL: http://www.yageo.com/; Packaging: TapeandReel; Case Code (Metric): 1608; Min Operating Temperature: -55degC; Composition: ThickFilm; RoHSCompliant: true; Contact Plating: Tin; Datasheet Version: Rev. 5, 10/2016; REACH SVHC: NoSVHC
TP2-TP5 = CMP-2000-05182-1: Test Point, White, 1-Pin THD, RoHS, Bulk; Manufacturer: KeystoneElectronics; Outside Diameter: 2.54mm; Plating: Silver; Mounting Hole Size: 1mm; Product: TestPoints; Packaging: Bulk; Manufacturer URL: http://www.keyelco.com/; Length: 7.62mm; Datasheet Version: Rev. G, 12/2008; Type: Miniature; Product Category: CircuitBoardHardware-PCB; Material: Nylon; RoHS: True; Contact Material: PhosphorBronze; Datasheet URL: https://ciiva.com/datasheet-click-2917627?src=ciiva&sig=bd195616; Color: White; Brand: KeystoneElectronics
U5 = SN65HVD70DGS: Integrated Circuit; Manufacturer_Name: Texas Instruments; Datasheet Link: http://www.ti.com/lit/gpn/SN65HVD70; Height: 1.1mm; Manufacturer_Part_Number: SN65HVD70DGS; Mouser Part Number: 595-SN65HVD70DGS; Mouser Price/Stock: https://www.mouser.co.uk/ProductDetail/Texas-Instruments/SN65HVD70DGS?qs=7z%252BmIopC6%2FJ5%2FtvmaE7XLg%3D%3D; Arrow Part Number: SN65HVD70DGS; Arrow Price/Stock: https://www.arrow.com/en/products/sn65hvd70dgs/texas-instruments
U7 U8 = MAX3280EAUK_V+T: Integrated Circuit; Manufacturer_Name: Maxim Integrated; Manufacturer_Part_Number: MAX3280EAUK/V+T; Datasheet Link: https://datasheets.maximintegrated.com/en/ds/MAX3280E-MAX3284E.pdf; Height: 1.45mm; Mouser Part Number: 700-MAX3280EAUK/V+T; Mouser Price/Stock: https://www.mouser.co.uk/ProductDetail/Maxim-Integrated/MAX3280EAUK-V%2bT?qs=0JU57JYmZjvEM6QBFAG%2FBw%3D%3D
U9 U10 = MAX3293AUT+T: Integrated Circuit; Manufacturer_Name: Maxim Integrated; Datasheet Link: https://datasheets.maximintegrated.com/en/ds/MAX3293-MAX3295.pdf; Height: 1.45mm; Manufacturer_Part_Number: MAX3293AUT+T; Mouser Part Number: 700-MAX3293AUTT; Mouser Price/Stock: https://www.mouser.co.uk/ProductDetail/Maxim-Integrated/MAX3293AUT%2bT?qs=CDqwynd4ZNpM6TG1t4AcuA%3D%3D

## Sheet MCU_F401RE.SchDoc
size A4; DocumentNumber: 4; SheetNumber: 4; SheetTotal: 5
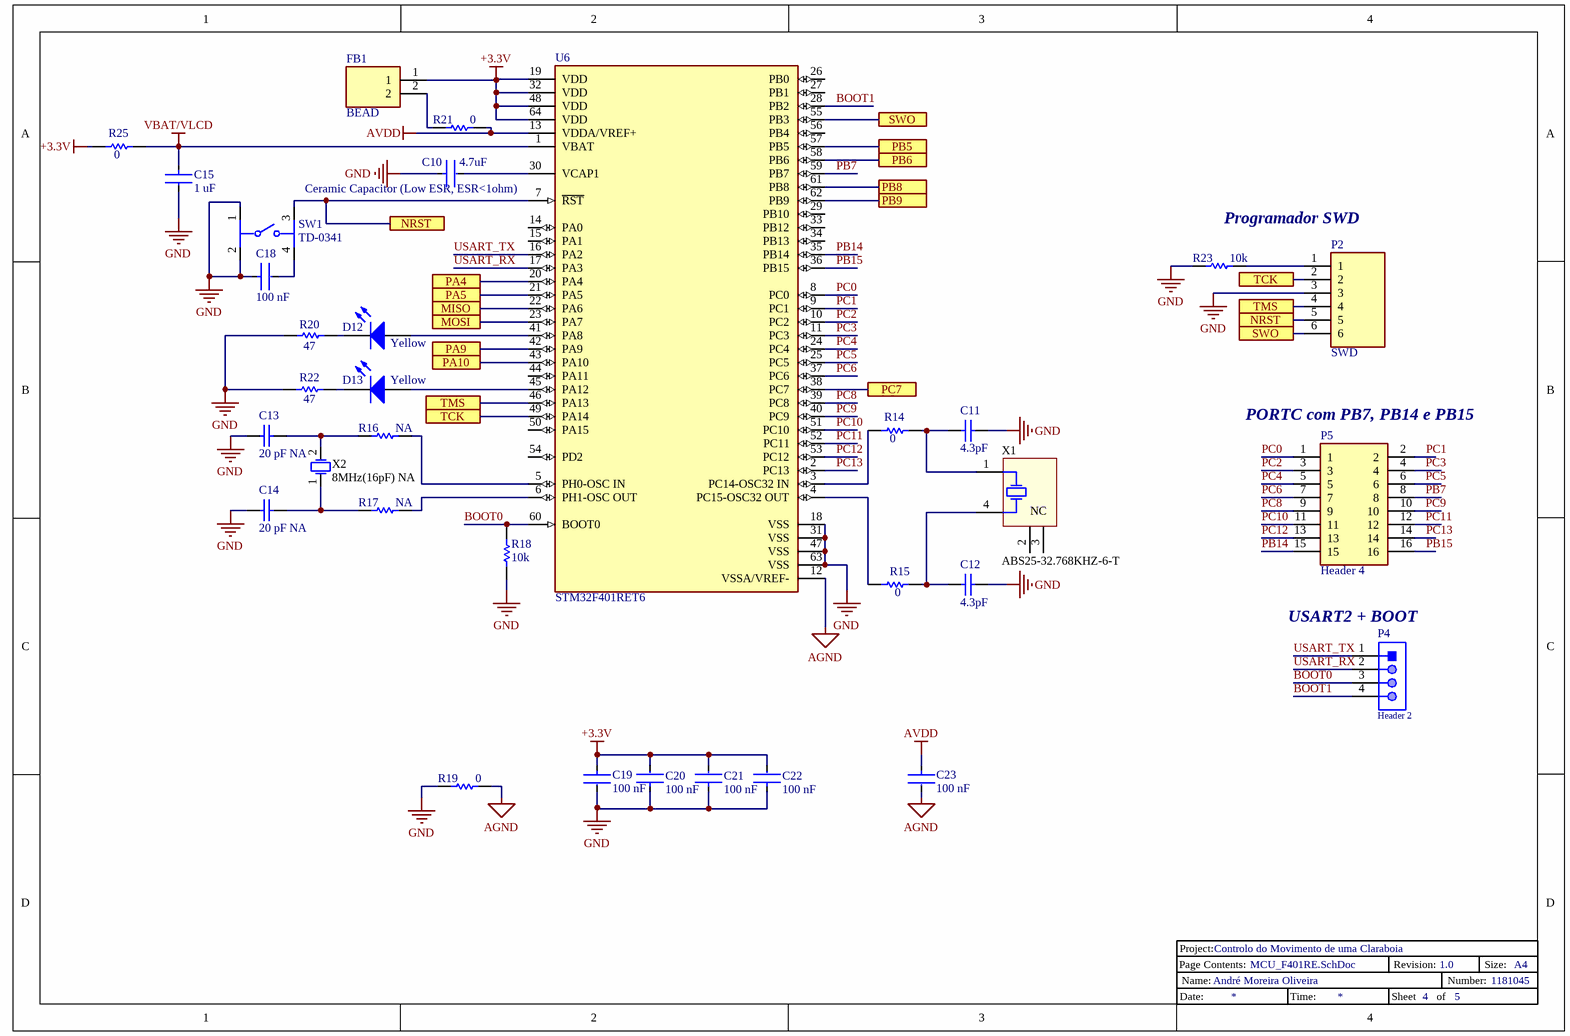
[diagram p3: MCU_F401RE.SchDoc]

### Parts
C10  4.7uF  [FP-GRT21B-0_15-IPC_B]
C11  4.3pF  [CAPC1608X90X35LL10T15]
C12  4.3pF  [CAPC1608X90X35LL10T15]
C13  20 pF NA  [CAPC1608X90X35NL15T15]
C14  20 pF NA  [CAPC1608X90X35NL15T15]
C15  1 uF  [FP-CC0603-DA-MFG]
C18  100 nF  [FP-CC0603-DA-MFG]
C19  100 nF  [FP-CC0603-DA-MFG]
C20  100 nF  [FP-CC0603-DA-MFG]
C21  100 nF  [FP-CC0603-DA-MFG]
C22  100 nF  [FP-CC0603-DA-MFG]
C23  100 nF  [FP-CC0603-DA-MFG]
D12  Yellow  [0805_A]
D13  Yellow  [0805_A]
FB1  BEAD  [BEADC1608X95N]
P2  SWD  [HDRV6W30P0X127_1X6_762X210X430P]
P4  Header 2  [61300411121]
P5  Header 4  [HDRV16W67P254_2X8_1991X488X821P]
R14  0  [RESC1608X55X25ML10T15]
R15  0  [RESC1608X55X25ML10T15]
R16  NA  [RESC1608X55X25ML10T15]
R17  NA  [RESC1608X55X25ML10T15]
R18  10k  [RESC1608X55X25ML10T15]
R19  0  [RESC1608X55X25ML10T15]
R20  47  [RESC1608X55X30NL20T20]
R21  0  [RESC1608X55X25ML10T15]
R22  47  [RESC1608X55X30NL20T20]
R23  10k  [RESC1608X55X25ML10T15]
R25  0  [RESC1608X55X25ML10T15]
SW1  TD-0341  [FP-1571563-9-MFG]
Title_Block_4  Title_Block  (value not drawn)
U6  STM32F401RET6  [FP-LQFP64-5W-MFG]
X1  ABS25-32.768KHZ-6-T  [ABRA-ABS25-4_V]
X2  8MHz(16pF) NA  [FOX-FOXSLF160-20]

### Ports
MISO, MOSI, NRST, PA4, PA5, PA9, PA10, PB5, PB6, PB8, PB9, PC7, SWO, TCK, TMS

### Nets
+3.3V: C19.1 C20.2 C21.2 C22.2 FB1.1 R25.1 U6.19(VDD) U6.32(VDD) U6.48(VDD) U6.64(VDD)
AGND: C23.2 R19.2 U6.12(VSSA/VREF-)
AVDD: C23.1 R21.2 U6.13(VDDA/VREF+)
GND: C10.1 C11.2 C12.2 C13.1 C14.1 C15.2 C18.1 C19.2 C20.1 C21.1 C22.1 P2.3 R18.1 R19.1 R20.2 R22.2 R23.1 SW1.1 SW1.2 U6.18(VSS) U6.31(VSS) U6.47(VSS) U6.63(VSS)
VBAT/VLCD: C15.1 R25.2 U6.1(VBAT)
BOOT0: P4.3 R18.2 U6.60(BOOT0)
BOOT1: P4.4 U6.28(PB2)
FLAG: U6.43(PA10) ; port PA10
PB7: P5.8 U6.59(PB7)
PB14: P5.15 U6.35(PB14)
PB15: P5.16 U6.36(PB15)
PC0: P5.1 U6.8(PC0)
PC1: P5.2 U6.9(PC1)
PC2: P5.3 U6.10(PC2)
PC3: P5.4 U6.11(PC3)
PC4: P5.5 U6.24(PC4)
PC5: P5.6 U6.25(PC5)
PC6: P5.7 U6.37(PC6)
PC8: P5.9 U6.39(PC8)
PC9: P5.10 U6.40(PC9)
PC10: P5.11 U6.51(PC10)
PC11: P5.12 U6.52(PC11)
PC12: P5.13 U6.53(PC12)
PC13: P5.14 U6.2(PC13)
STCK: U6.38(PC7) ; port PC7
USART_RX: P4.2 U6.17(PA3)
USART_TX: P4.1 U6.16(PA2)
NetC2_2: U6.61(PB8) ; port PB8
NetC4_2: U6.62(PB9) ; port PB9
NetC10_2: C10.2 U6.30(VCAP1)
NetC11_1: C11.1 R14.2 X1.1(X1)
NetC12_1: C12.1 R15.2 X1.4(X2)
NetC13_2: C13.2 R16.1 X2.2
NetC14_2: C14.2 R17.1 X2.1
NetC18_2: C18.2 SW1.4
NetC37_2: U6.42(PA9) ; port PA9
NetD12_1: D12.1(K) R20.1
NetD12_2: D12.2(A) U6.41(PA8)
NetD13_1: D13.1(K) R22.1
NetD13_2: D13.2(A) U6.45(PA12)
NetD29_1: U6.57(PB5) ; port PB5
NetFB1_2: FB1.2 R21.1
NetP2_1: P2.1 R23.2
NetP2_2: P2.2 U6.49(PA14) ; port TCK
NetP2_4: P2.4 U6.46(PA13) ; port TMS
NetP2_5: P2.5 SW1.3 U6.7(~{RST}) ; port NRST
NetP2_6: P2.6 U6.55(PB3) ; port SWO
NetR14_1: R14.1 U6.3(PC14-OSC32_IN)
NetR15_1: R15.1 U6.4(PC15-OSC32_OUT)
NetR16_2: R16.2 U6.5(PH0-OSC_IN)
NetR17_2: R17.2 U6.6(PH1-OSC_OUT)
NetR24_1: U6.58(PB6) ; port PB6
NetR36_1: U6.21(PA5) ; port PA5
NetR49_1: U6.23(PA7) ; port MOSI
NetR55_1: U6.22(PA6) ; port MISO
NetR56_2: U6.20(PA4) ; port PA4

Not connected (* = marked no-connect by the designer): U6 14(PA0) 15(PA1) 26(PB0) 27(PB1) 29(PB10) 33(PB12) 34(PB13) 44(PA11) 50(PA15) 54(PD2) 56(PB4); X1 2(NC) 3(NC)

### Notes on the sheet
- (near C10) Ceramic Capacitor (Low ESR, ESR<1ohm)
- Programador SWD
- (near P5) PORTC com PB7, PB14 e PB15
- (near P4) USART2 + BOOT
- (in symbol Title_Block) Project:; Page Contents:; Revision:; Size:; A4; Name:; Number:; Date:; Time:; Sheet; of

### Library data of the parts
C10 = CMP-06035-019733-1: as C5 on sheet Source; Voltage Rating: 50V; Mount: Surface Mount; Ratings: AEC-Q200; Packaging: Tape and Reel; Width: 0.049inch; Case/Package: 0805; Max Operating Temperature: 85°C; Length: 0.079inch; Case Code (Imperial): 0805; Capacitance: 4.7uF; Thickness: 0.057inch; Min Operating Temperature: -55°C; Case Code (Metric): 2012; Dielectric: X5R; Tolerance: 10%; Voltage Rating (DC): 50V
C11 C12 = CMP-2006-02448-1: 0603; Part Number: GQM1885C2A4R3BB01D; Manufacturer: Murata
C13 C14 = CMP-2006-04264-1: Part Number: 06035A200JAT2A; Manufacturer: AVX Interconnect / Elco
C15 = CMP-1035-02737-2: CAP CER 1UF 16V X5R 0603; Manufacturer Part Number: CC0603KRX5R7BB105; Manufacturer: YAGEO; Material: Ceramic; Temperature Coefficient: 15%; Tolerance: 0.1; Digikey Description: CAP CER 1UF 16V X5R 0603; Category: Cap; Automotive: No; Octopart: https://octopart.com/cc0603krx5r7bb105-yageo-8376530; Voltage Rating: 16 V; Device Class L3: Ceramic Capacitors; Value: 1 uF; Temperature Characteristic: X5R; Voltage: 16 V; RoHS: TRUE; Lead Free: Yes; Temperature: -55°C to +125°C; Device Class L2: Capacitors; ComponentLink2URL: http://www.yageo.com/documents/recent/UPY-GPHC_X7R_6.3V-to-50V_18.pdf; Capacitance: 1 uF; Footprint Url: http://www.yageo.com/exep/pages/download/literatures/UPY-C_GEN_24.pdf; Height: 0.9mm; ComponentLink2Description: Datasheet; Temperature Range High: +125°C; Mouser Description: Multilayer Ceramic Capacitors MLCC - SMD/SMT 1.0uF 16V X5R 10%; Package: CC0603-DA; Device Class L1: Passive Components; Temperature Range Low: -55°C
C18-C23 = CMP-2100-03601-2: as C1 on sheet Inputs; Height: 0.9mm; Voltage: 50 V; ComponentLink2Description: Datasheet; Device Class L2: Capacitors; Temperature Range High: +125°C; Category: Cap; Capacitance: 100 nF; Footprint Url: http://www.yageo.com/exep/pages/download/literatures/UPY-C_GEN_24.pdf; ComponentLink2URL: http://www.yageo.com/documents/recent/UPY-GPHC_X7R_6.3V-to-50V_18.pdf; Package: CC0603-DA; Temperature: -55°C to +125°C; Voltage Rating: 50 V; Temperature Characteristic: X7R; Device Class L1: Passive Components; Temperature Range Low: -55°C; RoHS: TRUE; Automotive: No; Value: 100 nF; Device Class L3: Ceramic Capacitors; Octopart: https://octopart.com/cc0603krx7r9bb104-yageo-42244635; Mouser Description: Multilayer Ceramic Capacitor, CC Series, 0.1 - F, - 10%, X7R, 50 V, 0603 [1608 Metric]; Lead Free: Yes; Digikey Description: CAP CER 0.1UF 50V X7R 0603
D12 D13 = CMP-1426-00012-1: SMD mono-color Chip LED, WL-SMCW, Yellow; Manufacturer: Wuerth Elektronik; PartNumber: 150080YS75000; Color: Yellow; ComponentLink1URL: http://www.we-online.com; PackageReference: 0805_A; ComponentLink2URL: http://katalog.we-online.com/led/datasheet/150080YS75000.pdf; ComponentLink1Description: Manufacturer URL; ComponentLink2Description: Datasheet
FB1 = MMZ1608S601ATD25: Ferrite Bead; Manufacturer_Name: TDK; Datasheet Link: https://datasheet.datasheetarchive.com/originals/dk/DKDS-25/489214.pdf; Height: 0.95mm; Manufacturer_Part_Number: MMZ1608S601ATD25; Mouser Part Number: 810-MMZ1608S601ATD25; Mouser Price/Stock: https://www.mouser.co.uk/ProductDetail/TDK/MMZ1608S601ATD25?qs=pvNC7ksEVIeMnkuqWHgErw%3D%3D; Arrow Part Number: MMZ1608S601ATD25; Arrow Price/Stock: https://www.arrow.com/en/products/mmz1608s601atd25/tdk
P2 = M50-3530642: Connector; Manufacturer_Name: Harwin; Datasheet Link: https://cdn.harwin.com/pdfs/M50-353.pdf; Height: 4.3mm; Manufacturer_Part_Number: M50-3530642; Mouser Part Number: 855-M50-3530642; Mouser Price/Stock: https://www.mouser.co.uk/ProductDetail/Harwin/M50-3530642?qs=%252BdQmOuGyFcHPs2UJx%2F79Cg%3D%3D
P4 = CMP-1502-01064-1: THT Vertical Pin Header WR-PHD, Pitch 2.54 mm, Single Row, 4 pins; Manufacturer: Wurth Elektronik; Withstanding Voltage: 500VAC; Rated Current: 3A; Working Voltage: 250VAC; Pin Number: 4; Gender: Male; Contact Resistance: 20mOhm; Pitch: 2.54mm; Manufacturer URL: http://www.we-online.de; Operating Temperature: -40to105degC; Packaging: Bag; Mounting Technology: THT; Package Reference: 61300411121; Datasheet URL: https://katalog.we-online.de/em/datasheet/6130xx11121.pdf; Publisher: WurthElektronik; Part Number: 61300411121; Row Number: Single; Orientation: Vertical
P5 = 5-146254-8: Connector; Manufacturer_Name: TE Connectivity; Datasheet Link: https://www.te.com/commerce/DocumentDelivery/DDEController?Action=srchrtrv&DocNm=146254&DocType=Customer+Drawing&DocLang=English; Height: 8.21mm; Manufacturer_Part_Number: 5-146254-8; Mouser Part Number: 571-5-146254-8; Mouser Price/Stock: https://www.mouser.co.uk/ProductDetail/TE-Connectivity/5-146254-8?qs=bwpFY26eRVeR6qljXzz%2FRg%3D%3D; Arrow Part Number: 5-146254-8; Arrow Price/Stock: https://www.arrow.com/en/products/5-146254-8/te-connectivity
R14-R17 R19 R21 R25 = CMP-2100-03667-1: as R1 on sheet Inputs; Width: 0.8mm; Max Operating Temperature: 155degC; Tolerance: 5%; Package Reference: 0603; Height: 0.45mm; Depth: 0.8mm; Package Description: 2-Pin Surface Mount Device, Body 1.6 x 0.8 mm; Termination: SMD/SMT; Package Quantity: 5000; Case/Package: 0603; Case Code (Imperial): 0603; Radiation Hardening: No; Number of Pins: 2; Length: 1.6mm; Lead Free: LeadFree; Voltage Rating (DC): 50V; Military Standard: Not; Datasheet URL: http://www.yageo.com/NewPortal/yageodocoutput?fileName=/pdf/R-Chip/PYu-RC_Group_51_RoHS_L_5.pdf; Manufacturer URL: http://www.yageo.com/; Packaging: TapeandReel; Case Code (Metric): 1608; Min Operating Temperature: -55degC; Composition: ThickFilm; RoHSCompliant: true; Contact Plating: Tin; Datasheet Version: Rev. 5, 10/2016; REACH SVHC: NoSVHC
R18 R23 = CMP-2000-05022-1: as R64 on sheet Source; Package Reference: 603; Series: RC; Case Code - mm: 1608; Packaging: Reel; Datasheet URL: http://www.farnell.com/datasheets/443971.pdf; Datasheet Version: Rev. 4, 04/2009; Operating Temperature Range: -55Cto+155C; Product: ThickFilmResistorsGeneralPurpose; Package Description: 2-Pin Surface Mount Device, Body 1.6 x 0.8 mm; Manufacturer URL: http://www.yageo.com/; Case Code - in: 0603; Tolerance: 5%; Termination Style: SMD/SMT
R20 R22 = CMP-2000-00070-1: as R5 on sheet Source
SW1 = CMP-03402-000005-1: SWITCH TACTILE SPST-NO 0.05A 24V; Manufacturer: TE Connectivity; Manufacturer Part Number: 1571563-9; Standoff Height: 0.05mm; Electromechanical Life: 100000Cycles; Contact Resistance: 100mΩ; Operating Force: 160gf; Contact Current Rating: 50mA; Automotive: No; Device Class L1: Electromechanical; Voltage Rating Dc: 24V; ComponentLink2Description: Datasheet; Mount: Surface Mount; RoHS: TRUE; Temperature: -35°C to +85°C; ComponentLink2URL: https://www.te.com/commerce/DocumentDelivery/DDEController?Action=showdoc&DocId=Customer+Drawing%7F2-1437565-7%7FV%7Fpdf%7FEnglish%7FENG_CD_2-1437565-7_V.pdf%7F1571563-9; Temperature Range Low: -35°C; Lead Free: Yes; Device Class L2: Switches; Package: SMT_SW_6MM0_6MM0; Octopart: https://octopart.com/1571563-9-te+connectivity-41253969; Throw Configuration: SPST-NO; Mouser Description: Tactile Switches SPST OFF(ON) RND SMT MINI PB TACT SWITCH; Temperature Range High: +85°C; Digikey Description: SWITCH TACTILE SPST-NO 0.05A 24V; Device Class L3: Pushbutton Switches; Category: Switch; Height: 9.75mm
U6 = CMP-12105-000004-1: IC MCU 32BIT 512KB FLASH 64LQFP; Manufacturer: STMicroelectronics; Memory Size: 512KBytes; Number Of Cores: 1; Max Junction Temp: +105°C; Ram Size: 96KBytes; Number Of Adc Channels: 12; Number Of Pwm Channels: 23; Standoff Height: 0.05mm; Frequency: 84MHz; Number Of Timers/Counters: 8; Number Of I/Os: 50; Interface: I2C,SPI,USART,USB,IrDA,I2S,SMBus,Other; Number Of I2C Channels: 3; Max Supply Voltage: 3.6V; Data Bus Width: 32bits; Core Architecture: ARM Cortex-M4; Min Supply Voltage: 1.65V; Category: IC; Device Class L3: Microcontrollers; ComponentLink2URL: https://www.st.com/resource/en/datasheet/stm32f401re.pdf; RoHS: TRUE; Temperature Range High: +105°C; Device Class L2: Embedded Processors and Controllers; ComponentLink2Description: Datasheet; Temperature Range Low: -40°C; Digikey Description: IC MCU 32BIT 512KB FLASH 64LQFP; Package: LQFP64-5W; Manufacturer Part Number: STM32F401RET6; Number Of A/D Converters: 1; Ipc Land Pattern Name: QFP50P1200X1200X160-64; Automotive: No; Ambient Temperature Range Low: -40°C; Height: 1.6mm; Octopart: https://octopart.com/stm32f401ret6-stmicroelectronics-34185993; Ambient Temperature Range High: +85°C; Device Class L1: Integrated Circuits (ICs); Temperature: -40°C to +105°C; Number Of Spi Channels: 3; Number Of Uart Channels: 3; Memory Type: FLASH; Number Of Usb Channels: 1; Lead Free: Yes; Mouser Description: ARM Microcontrollers - MCU 16/32-BITS MICROS
X1 = CMP-2000-05036-1: Low Frequency Crystal, 32.768 KHz, 6 pF, +/- 20 ppm, -40 to 85 degC, 4-Pin SMD, RoHS, Tape and Reel; Manufacturer: Abracon; Tolerance: 20PPM; ESR: 50kOhms; Case Width: 3.8mm; Case Height: 2.5mm; Case Length: 8mm; Load Capacitance: 6pF; Operating Temperature Range: -40Cto+85C; Package Reference: ABS25; Factory Pack Quantity: 3000; Package Description: 4-Pin Surface Mount Device, Body 8 x 3.8 mm, Pitch 5.5 mm; Frequency: 32.768kHz; Termination Style: SMD/SMT; Manufacturer URL: http://www.abracon.com/; Type: LowFrequencyCrystal; Dimensions: 3.8mmWx8mmLx2.5mmH; Product Category: Crystals; Series: ABS25; RoHS: Details; Package / Case: 8mmx3.8mm; Datasheet Version: Jun-17; Brand: ABRACON; Datasheet URL: https://datasheet.ciiva.com/854/abs25-854528.pdf; Packaging: Reel; Mounting Style: SMD/SMT
X2 = CMP-1749-00003-1: Resistance Weld Thru-Hole Crystal, 16 MHz, -20 to 70 degC, 2-Pin THD, RoHS, Bulk; Voltage Rating: 250 V; Tolerance: 1%; Resistance: 221 kohm; Case\Package: Axial; Power Rating: 250 mW; RoHSCompliant: true; Package Quantity: 200; Packaging: Bulk; Min Operating Temperature: -55 degC; DatasheetVersion: Mar-15; ComponentLink1URL: http://www.foxonline.com/; Max Operating Temperature: 155 degC; PackageReference: FOXSLF160-20; Mount: Through Hole; PackageDescription: 2-Pin Through Hole Device, Body 11.35 x 4.65 mm; ComponentLink1Description: Manufacturer URL; ComponentLink2URL: http://www.foxonline.com/pdfs/hc49slf.pdf; ComponentLink2Description: Datasheet; Length: 0.248 inch